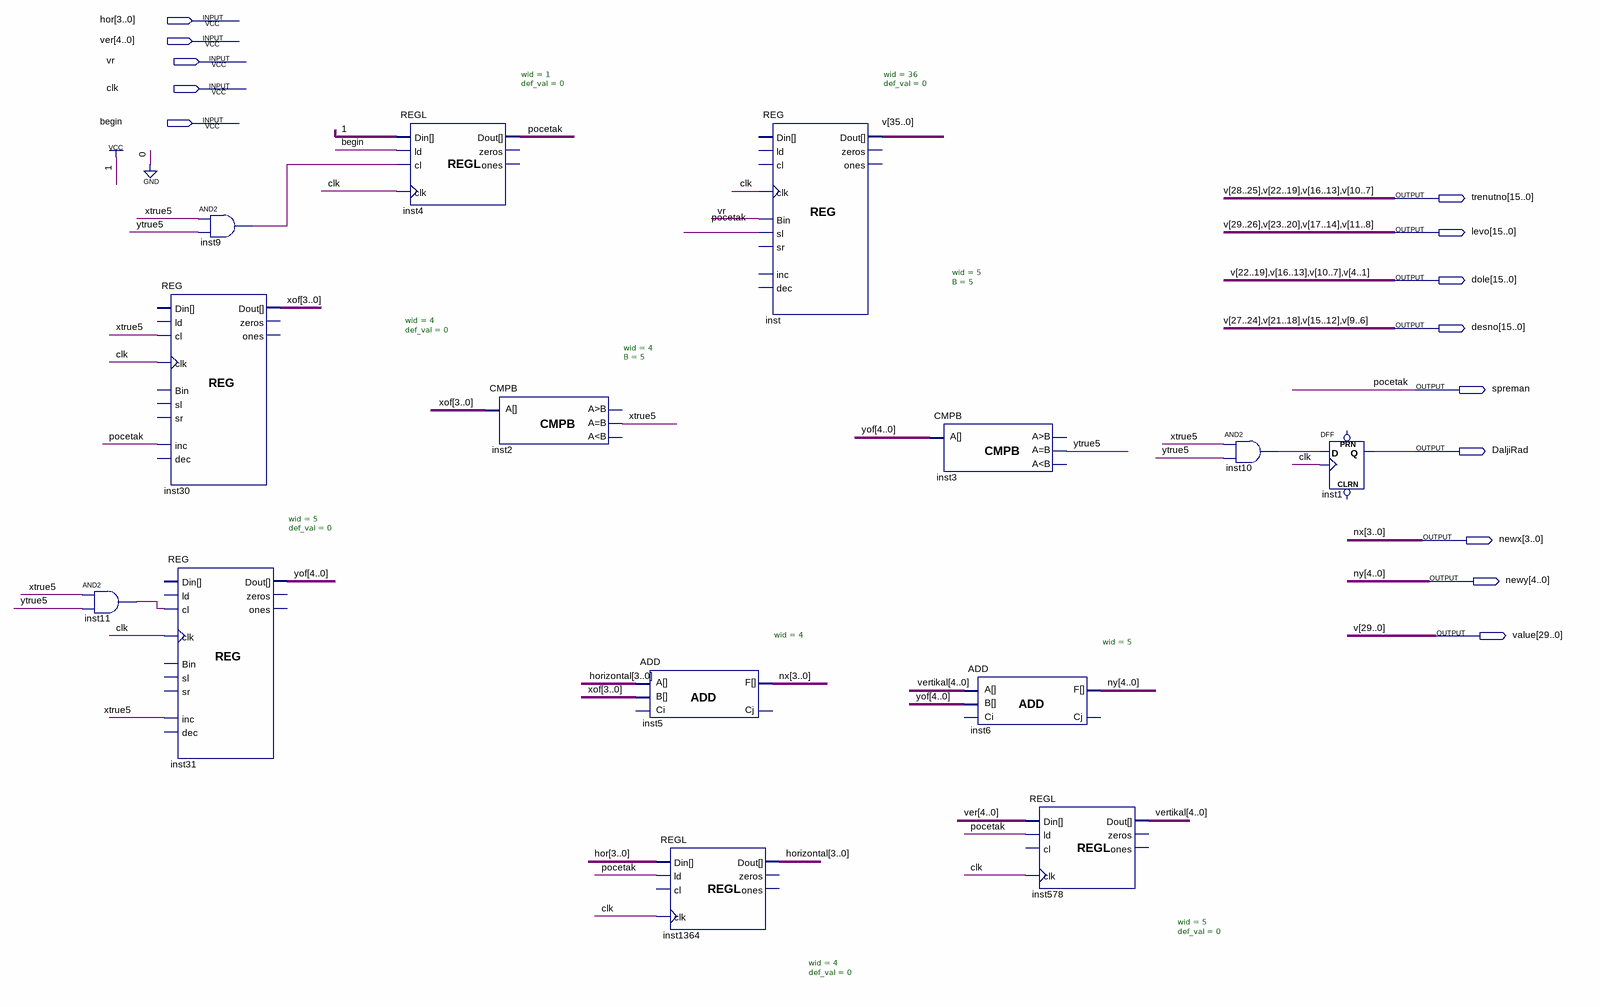
[diagram p0: schematic sheet]
// Quartus schematic generisanje.bdf as structural Verilog: 14 symbols, 14 pins
module generisanje (
  input  [3:0] hor,
  input  [4:0] ver,
  input  vr,
  input  clk,
  input  \begin ,
  output [15:0] trenutno,
  output [15:0] levo,
  output [15:0] dole,
  output [15:0] desno,
  output spreman,
  output DaljiRad,
  output [3:0] newx,
  output [4:0] newy,
  output [29:0] value
);

  wire inst9_out, inst10_out, inst11_out, xtrue5, ytrue5;
  wire [3:0] horizontal, xof;
  wire [4:0] vertikal, yof;
  wire [35:30] v;

  and inst11 (inst11_out, xtrue5, ytrue5);
  and inst9 (inst9_out, xtrue5, ytrue5);
  REG #(.wid(4), .def_val(0)) inst30 (
    .cl(xtrue5), .clk(clk), .inc(spreman), .Dout(xof));  // open: ld, Bin, sl, sr, dec, Din, zeros, ones
  REG #(.wid(5), .def_val(0)) inst31 (
    .cl(inst11_out), .clk(clk), .inc(xtrue5), .Dout(yof));  // open: ld, Bin, sl, sr, dec, Din, zeros, ones
  REGL #(.wid(1), .def_val(0)) inst4 (
    .Din(1'b1), .ld(\begin ), .cl(inst9_out), .clk(clk), .Dout(spreman));  // open: zeros, ones
  CMPB #(.wid(4), .B(5)) inst2 (.A(xof), .eq(xtrue5));  // open: gr, ls
  ADD #(.wid(4)) inst5 (.A(horizontal), .B(xof), .F(newx));  // open: Ci, Cj
  REGL #(.wid(4), .def_val(0)) inst1364 (
    .Din(hor), .ld(spreman), .clk(clk), .Dout(horizontal));  // open: cl, zeros, ones
  REG #(.wid(36), .def_val(0)) inst (
    .clk(clk), .Bin(vr), .sl(spreman),
    .Dout({v, levo[15:14], desno[15:12], levo[11], dole[15], desno[11:8], levo[7], dole[11], desno[7:4], levo[3], dole[7], desno[3:0], value[5], dole[3:0], value[0]}));  // open: ld, cl, sr, inc, dec, Din, zeros, ones
  CMPB #(.wid(5), .B(5)) inst3 (.A(yof), .eq(ytrue5));  // open: gr, ls
  ADD #(.wid(5)) inst6 (.A(vertikal), .B(yof), .F(newy));  // open: Ci, Cj
  REGL #(.wid(5), .def_val(0)) inst578 (.Din(ver), .ld(spreman), .clk(clk), .Dout(vertikal));  // open: cl, zeros, ones
  and inst10 (inst10_out, xtrue5, ytrue5);
  DFF inst1 (.CLK(clk), .D(inst10_out), .Q(DaljiRad));  // open: CLRN, PRN

  assign {dole[14:12], dole[10:8], dole[6:4]} = {desno[11:9], desno[7:5], desno[3:1]};
  assign {levo[13:12], levo[10:8], levo[6:4], levo[2:0]} = {desno[15:14], dole[15], desno[11:10], dole[11], desno[7:6], dole[7], desno[3:2]};
  assign trenutno = {levo[14], desno[15:13], dole[15], desno[11:9], dole[11], desno[7:5], dole[7], desno[3:1]};
  assign {value[29:6], value[4:1]} = {levo[15:14], desno[15:12], levo[11], dole[15], desno[11:8], levo[7], dole[11], desno[7:4], levo[3], dole[7], desno[3:0], dole[3:0]};

  // Other names for the same wires on the sheet: nx[3:0] = newx; ny[4:0] = newy; pocetak = spreman;
  //   v[29:0] = {levo[15:14], desno[15:12], levo[11], dole[15], desno[11:8], levo[7], dole[11], desno[7:4], levo[3], dole[7], desno[3:0], value[5], dole[3:0], value[0]}
endmodule
